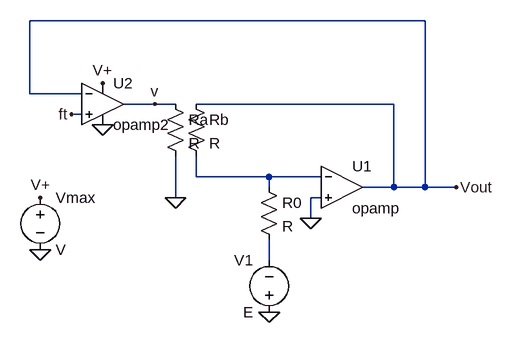
[diagram p0: schematic kadai2.asc]
kadai2.asc, the LTspice schematic file:
Version 4
SHEET 1 880 680
WIRE 432 0 -176 0
WIRE -176 112 -176 0
WIRE -96 112 -176 112
WIRE 16 128 -32 128
WIRE 48 128 16 128
WIRE 384 128 80 128
WIRE -96 144 -112 144
WIRE 80 240 80 208
WIRE 192 240 80 240
WIRE 272 240 192 240
WIRE 192 256 192 240
WIRE 384 256 384 128
WIRE 384 256 336 256
WIRE 432 256 432 0
WIRE 432 256 384 256
WIRE 480 256 432 256
WIRE 48 272 48 208
WIRE 272 272 256 272
WIRE 256 304 256 272
WIRE 192 368 192 336
FLAG 192 448 0
FLAG 256 304 0
FLAG 480 256 Vout
FLAG -112 144 ft
FLAG 48 272 0
FLAG -64 160 0
FLAG -160 352 0
FLAG -160 272 V+
FLAG -64 96 V+
FLAG 16 128 v
SYMBOL res 32 112 R0
SYMATTR InstName Ra
SYMBOL res 64 112 R0
SYMATTR InstName Rb
SYMBOL res 176 240 R0
SYMATTR InstName R0
SYMBOL voltage 192 464 R180
WINDOW 0 24 96 Left 2
WINDOW 3 24 16 Left 2
SYMATTR InstName V1
SYMATTR Value E
SYMBOL OpAmps\\opamp 304 192 R0
SYMATTR InstName U1
SYMBOL OpAmps\\opamp2 -64 64 R0
SYMATTR InstName U2
SYMBOL voltage -160 256 R0
SYMATTR InstName Vmax

The netlist it stands for:
* kadai2.asc
Ra v 0 R
Rb Vout N001 R
R0 N001 N002 R
V1 0 N002 E
XU1 N001 0 Vout opamp Aol=100K GBW=10Meg  ; pins invin noninvin out
XU2 ft Vout V+ 0 v opamp2  ; pins In+ In- V+ V- OUT
Vmax V+ 0 V
.backanno
.end